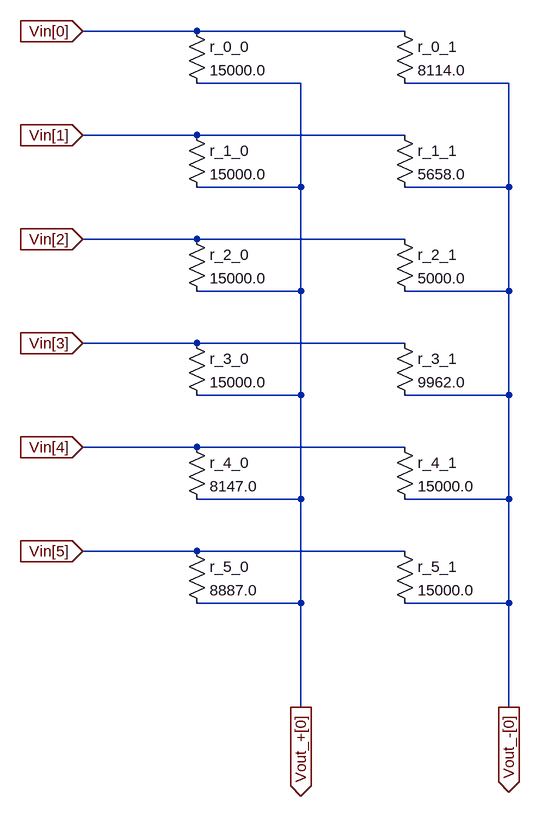
[diagram p0: schematic X_cbar_6by2.asc]
X_cbar_6by2.asc, the LTspice schematic file:
Version 4 
SHEET 1 2360 680
WIRE -160 16 336 16
WIRE -160 176 336 176
WIRE -160 336 336 336
WIRE -160 496 336 496
WIRE -160 656 336 656
WIRE -160 816 336 816
WIRE 16 96 176 96
WIRE 176 96 176 256
WIRE 336 96 496 96
WIRE 496 96 496 256
WIRE 16 256 176 256
WIRE 176 256 176 416
WIRE 336 256 496 256
WIRE 496 256 496 416
WIRE 16 416 176 416
WIRE 176 416 176 576
WIRE 336 416 496 416
WIRE 496 416 496 576
WIRE 16 576 176 576
WIRE 176 576 176 736
WIRE 336 576 496 576
WIRE 496 576 496 736
WIRE 16 736 176 736
WIRE 176 736 176 896
WIRE 336 736 496 736
WIRE 496 736 496 896
WIRE 16 896 176 896
WIRE 176 896 176 1056
WIRE 336 896 496 896
WIRE 496 896 496 1056
FLAG -160 16 Vin[0]
IOPIN -160 16 In
FLAG -160 176 Vin[1]
IOPIN -160 176 In
FLAG -160 336 Vin[2]
IOPIN -160 336 In
FLAG -160 496 Vin[3]
IOPIN -160 496 In
FLAG -160 656 Vin[4]
IOPIN -160 656 In
FLAG -160 816 Vin[5]
IOPIN -160 816 In
FLAG 176 1056 Vout_+[0]
IOPIN 176 1056 Out
FLAG 496 1056 Vout_-[0]
IOPIN 496 1056 Out
SYMBOL res 0 0 R0
SYMATTR InstName r_0_0
SYMATTR Value 15000.0
SYMBOL res 320 0 R0
SYMATTR InstName r_0_1
SYMATTR Value 8114.0
SYMBOL res 0 160 R0
SYMATTR InstName r_1_0
SYMATTR Value 15000.0
SYMBOL res 320 160 R0
SYMATTR InstName r_1_1
SYMATTR Value 5658.0
SYMBOL res 0 320 R0
SYMATTR InstName r_2_0
SYMATTR Value 15000.0
SYMBOL res 320 320 R0
SYMATTR InstName r_2_1
SYMATTR Value 5000.0
SYMBOL res 0 480 R0
SYMATTR InstName r_3_0
SYMATTR Value 15000.0
SYMBOL res 320 480 R0
SYMATTR InstName r_3_1
SYMATTR Value 9962.0
SYMBOL res 0 640 R0
SYMATTR InstName r_4_0
SYMATTR Value 8147.0
SYMBOL res 320 640 R0
SYMATTR InstName r_4_1
SYMATTR Value 15000.0
SYMBOL res 0 800 R0
SYMATTR InstName r_5_0
SYMATTR Value 8887.0
SYMBOL res 320 800 R0
SYMATTR InstName r_5_1
SYMATTR Value 15000.0

The netlist it stands for:
* X_cbar_6by2.asc
r_0_0 Vin[0] Vout_+[0] 15000.0
r_0_1 Vin[0] Vout_-[0] 8114.0
r_1_0 Vin[1] Vout_+[0] 15000.0
r_1_1 Vin[1] Vout_-[0] 5658.0
r_2_0 Vin[2] Vout_+[0] 15000.0
r_2_1 Vin[2] Vout_-[0] 5000.0
r_3_0 Vin[3] Vout_+[0] 15000.0
r_3_1 Vin[3] Vout_-[0] 9962.0
r_4_0 Vin[4] Vout_+[0] 8147.0
r_4_1 Vin[4] Vout_-[0] 15000.0
r_5_0 Vin[5] Vout_+[0] 8887.0
r_5_1 Vin[5] Vout_-[0] 15000.0
.backanno
.end